# Altium schematic sheet ADS1299.SchDoc
size A; SheetNumber: 1; SheetTotal: 1
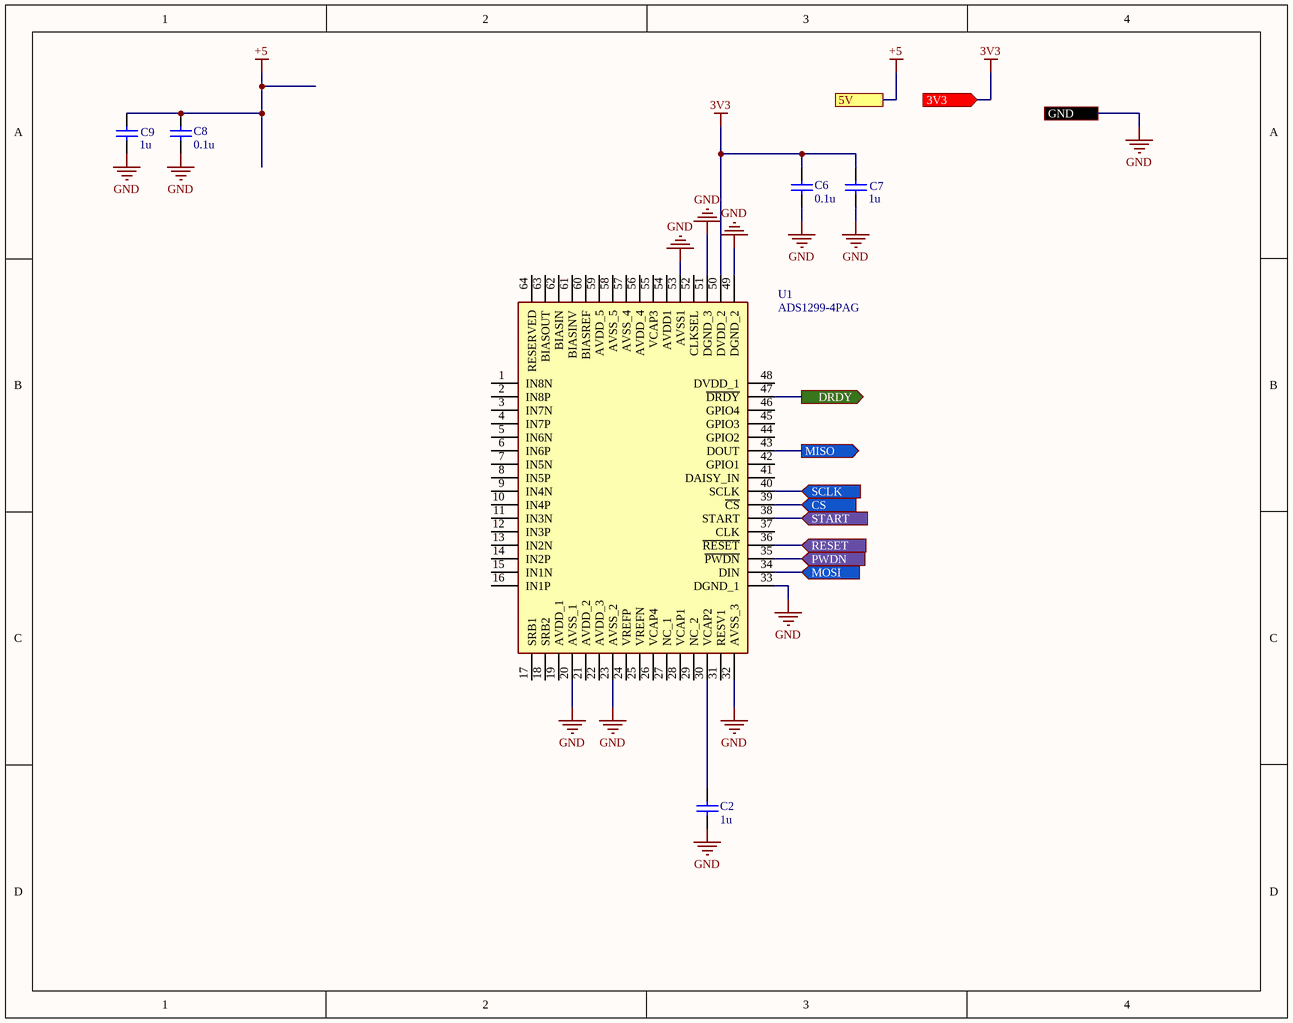
[diagram p0: ADS1299.SchDoc]

## Parts
C2  value 1u  (hidden comment: Capacitor)
C6  value 0.1u  (hidden comment: Capacitor)
C7  value 1u  (hidden comment: Capacitor)
C8  value 0.1u  (hidden comment: Capacitor)
C9  value 1u  (hidden comment: Capacitor)
U1  ADS1299-4PAG  [QFP50P1200X1200X120-64N]

## Ports
3V3 (in), 5V, CS (in), DRDY (out), GND, MISO (out), MOSI (in), PWDN (in), RESET (in), SCLK (in), START (in)

## Nets
3V3: C6.2 C7.2 U1.50(DVDD_2) ; port 3V3
+5: C8.2 C9.2 ; port 5V
GND: C2.2 C6.1 C7.1 C8.1 C9.1 U1.20(AVSS_1) U1.23(AVSS_2) U1.32(AVSS_3) U1.33(DGND_1) U1.49(DGND_2) U1.51(DGND_3) U1.53(AVSS1) ; port GND
CS: U1.39(~{CS}) ; port CS
DRDY: U1.47(~{DRDY}) ; port DRDY
MISO: U1.43(DOUT) ; port MISO
MOSI: U1.34(DIN) ; port MOSI
PWDN: U1.35(~{PWDN}) ; port PWDN
RESET: U1.36(~{RESET}) ; port RESET
SCLK: U1.40(SCLK) ; port SCLK
START: U1.38(START) ; port START
NetC2_1: C2.1 U1.30(VCAP2)

Not connected (* = marked no-connect by the designer): U1 1(IN8N) 2(IN8P) 3(IN7N) 4(IN7P) 5(IN6N) 6(IN6P) 7(IN5N) 8(IN5P) 9(IN4N) 10(IN4P) 11(IN3N) 12(IN3P) 13(IN2N) 14(IN2P) 15(IN1N) 16(IN1P) 17(SRB1) 18(SRB2) 19(AVDD_1) 21(AVDD_2) 22(AVDD_3) 24(VREFP) 25(VREFN) 26(VCAP4) 27(NC_1) 28(VCAP1) 29(NC_2) 31(RESV1) 37(CLK) 41(DAISY_IN) 42(GPIO1) 44(GPIO2) 45(GPIO3) 46(GPIO4) 48(DVDD_1) 52(CLKSEL) 54(AVDD1) 55(VCAP3) 56(AVDD_4) 57(AVSS_4) 58(AVSS_5) 59(AVDD_5) 60(BIASREF) 61(BIASINV) 62(BIASIN) 63(BIASOUT) 64(RESERVED)

## Library data of the parts
C2 C6-C9 = Capacitor: SimulationGenericComponent: True
U1 = ADS1299-4PAG: Low-Noise, 4-Channel, 24-Bit Analog-to-Digital Converter for Biopotential Measurements; Manufacturer_Name: Texas Instruments; Geometry.Height: 1.2mm; Mouser Part Number: 595-ADS1299-4PAG; Mouser Price/Stock: https://www.mouser.co.uk/ProductDetail/Texas-Instruments/ADS1299-4PAG?qs=9lcNTSmDlCovTG3JfbaYgg%3D%3D; Manufacturer_Part_Number: ADS1299-4PAG; Datasheet Link: http://www.ti.com/lit/gpn/ads1299-4